# EAGLE design SNAC  7ch SMS DB9 3D (EAGLE 9.0.1)
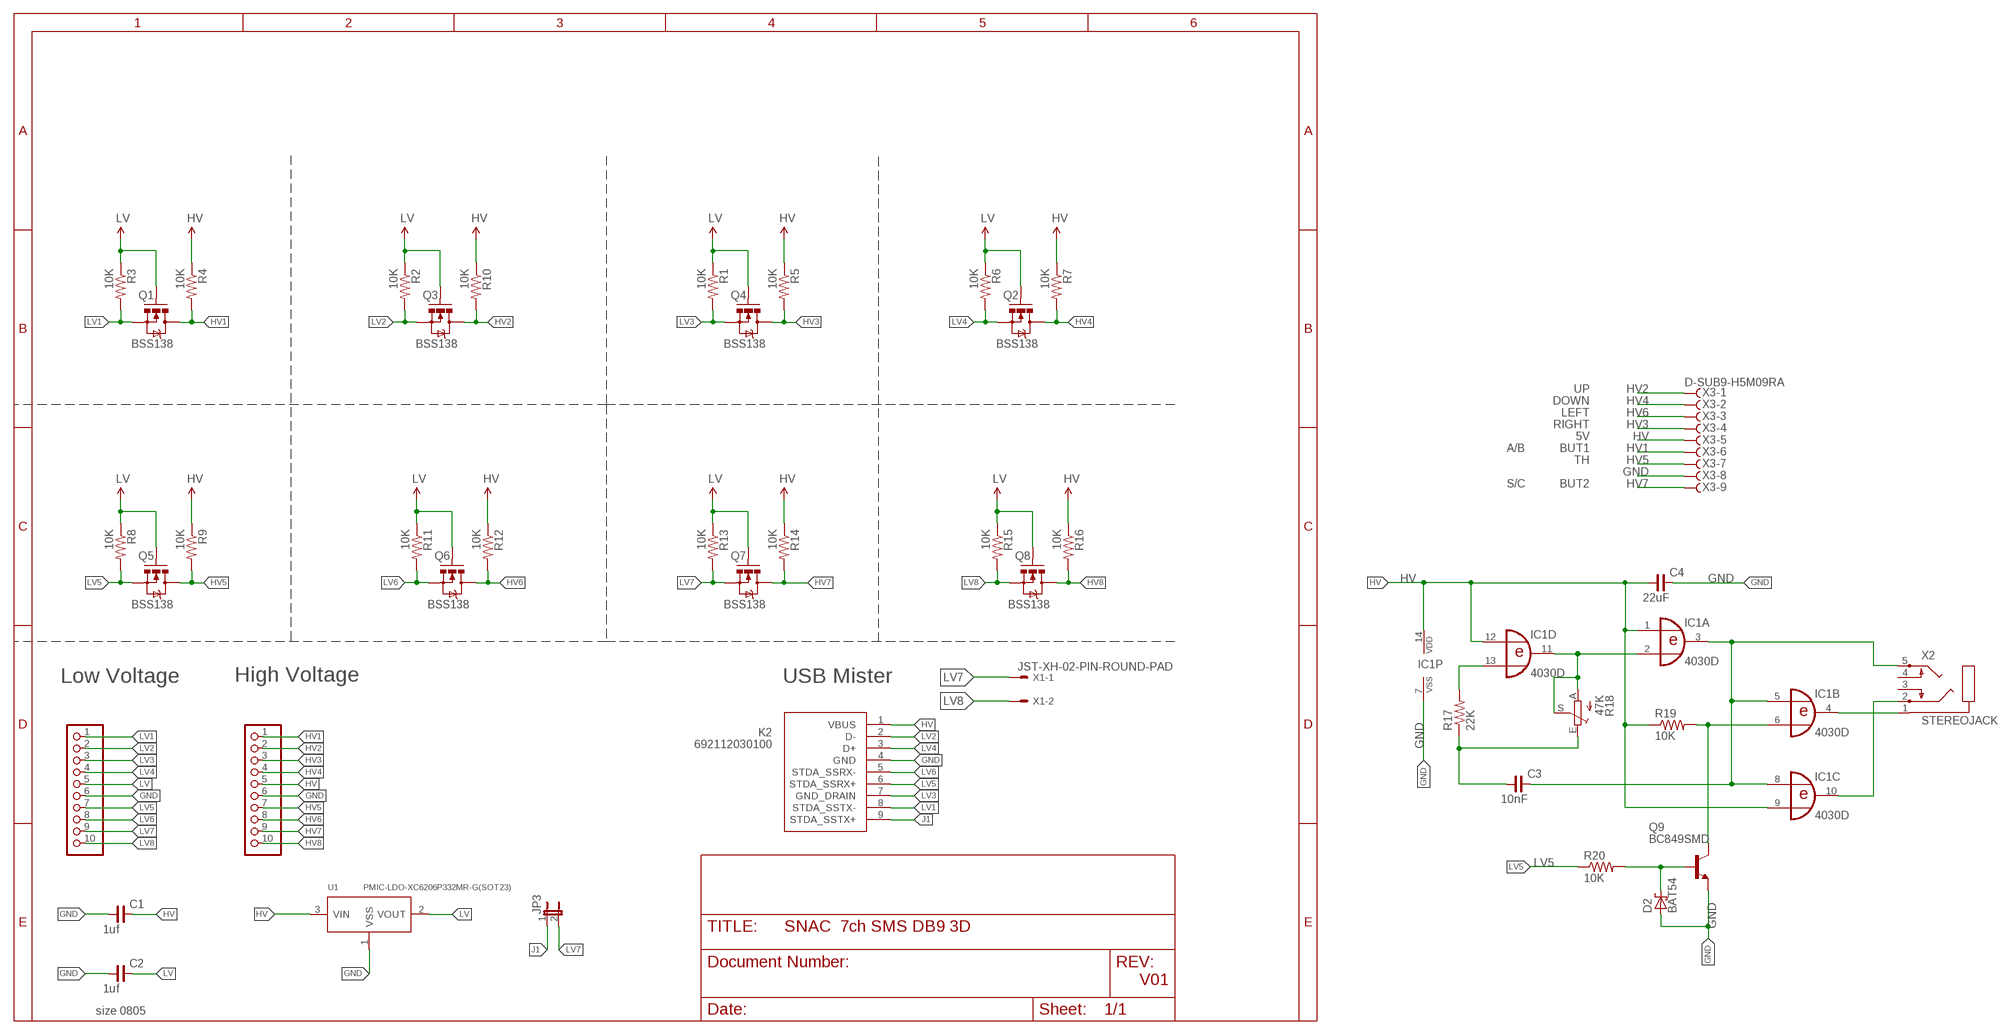
[diagram p0: schematic, sheet 1]

## Parts
C1  1uf  C_0805  [C0805]
C2  1uf  C_0805  [C0805]
C3  10nF  C_0805  [C0805]
C4  22uF  C_0805  [C0805]
D2  BAT54  [SOT23]
IC1  4030D  [SO14]
JP1  PINHD-1X10_2.54-S  [1X10-S]
JP2  PINHD-1X10_2.54-S  [1X10-S]
JP3  JUMPER-2PTH  [1X02]
K2  692112030100  [692112030100]
Q1  BSS138  MOSFET-NCHANNELSMD  [SOT23-3]
Q2  BSS138  MOSFET-NCHANNELSMD  [SOT23-3]
Q3  BSS138  MOSFET-NCHANNELSMD  [SOT23-3]
Q4  BSS138  MOSFET-NCHANNELSMD  [SOT23-3]
Q5  BSS138  MOSFET-NCHANNELSMD  [SOT23-3]
Q6  BSS138  MOSFET-NCHANNELSMD  [SOT23-3]
Q7  BSS138  MOSFET-NCHANNELSMD  [SOT23-3]
Q8  BSS138  MOSFET-NCHANNELSMD  [SOT23-3]
Q9  BC849SMD  [SOT23-BEC]
R1  10K  RESISTOR0603-RES  [0603-RES]
R2  10K  RESISTOR0603-RES  [0603-RES]
R3  10K  RESISTOR0603-RES  [0603-RES]
R4  10K  RESISTOR0603-RES  [0603-RES]
R5  10K  RESISTOR0603-RES  [0603-RES]
R6  10K  RESISTOR0603-RES  [0603-RES]
R7  10K  RESISTOR0603-RES  [0603-RES]
R8  10K  RESISTOR0603-RES  [0603-RES]
R9  10K  RESISTOR0603-RES  [0603-RES]
R10  10K  RESISTOR0603-RES  [0603-RES]
R11  10K  RESISTOR0603-RES  [0603-RES]
R12  10K  RESISTOR0603-RES  [0603-RES]
R13  10K  RESISTOR0603-RES  [0603-RES]
R14  10K  RESISTOR0603-RES  [0603-RES]
R15  10K  RESISTOR0603-RES  [0603-RES]
R16  10K  RESISTOR0603-RES  [0603-RES]
R17  22K  RESISTOR0603-RES  [0603-RES]
R18  47K  TRIM_EU-B25P  [B25P]
R19  10K  RESISTOR0603-RES  [0603-RES]
R20  10K  RESISTOR0603-RES  [0603-RES]
U1  PMIC-LDO-XC6206P332MR-G(SOT23)  [SOT-23]
X1  JST-XH-02-PIN-ROUND-PAD  [JST-XH-02-PACKAGE-ROUND-PAD]
X2  STEREOJACK  [STX3100]
X3  D-SUB9-H5M09RA  [H5M09RA]

## Nets
GND: C1.1 C2.1 C4.2 D2.1(A) IC1.7(P:VSS) JP1.6 JP2.6 K2.4(GND) Q9.E U1.1(VSS) X3.8
HV: C1.2 C4.1 IC1.1(A:I0) IC1.9(C:I1) IC1.12(D:I0) IC1.14(P:VDD) JP2.5 K2.1(VBUS) R4.1 R5.1 R7.1 R9.1 R10.1 R12.1 R14.1 R16.1 R19.1 U1.3(VIN) X3.5
HV1: JP2.1 Q1.3(D) R4.2 X3.6
HV2: JP2.2 Q3.3(D) R10.2 X3.1
HV3: JP2.3 Q4.3(D) R5.2 X3.4
HV4: JP2.4 Q2.3(D) R7.2 X3.2
HV5: JP2.7 Q5.3(D) R9.2 X3.7
HV6: JP2.8 Q6.3(D) R12.2 X3.3
HV7: JP2.9 Q7.3(D) R14.2 X3.9
HV8: JP2.10 Q8.3(D) R16.2
J1: JP3.1 K2.9(STDA_SSTX+)
LV: C2.2 JP1.5 Q1.1(G) Q2.1(G) Q3.1(G) Q4.1(G) Q5.1(G) Q6.1(G) Q7.1(G) Q8.1(G) R1.1 R2.1 R3.1 R6.1 R8.1 R11.1 R13.1 R15.1 U1.2(VOUT)
LV1: JP1.1 K2.8(STDA_SSTX-) Q1.2(S) R3.2
LV2: JP1.2 K2.2(D-) Q3.2(S) R2.2
LV3: JP1.3 K2.7(GND_DRAIN) Q4.2(S) R1.2
LV4: JP1.4 K2.3(D+) Q2.2(S) R6.2
LV5: JP1.7 K2.6(STDA_SSRX+) Q5.2(S) R8.2 R20.1
LV6: JP1.8 K2.5(STDA_SSRX-) Q6.2(S) R11.2
LV7: JP1.9 JP3.2 Q7.2(S) R13.2 X1.1
LV8: JP1.10 Q8.2(S) R15.2 X1.2
N$5: IC1.2(A:I1) IC1.11(D:O) R18.A R18.S
N$6: C3.2 IC1.3(A:O) IC1.5(B:I0) IC1.8(C:I0) X2.5
N$7: IC1.4(B:O) X2.1
N$8: IC1.10(C:O) X2.2
N$9: C3.1 R17.1 R18.E
N$10: IC1.13(D:I1) R17.2
N$13: IC1.6(B:I1) Q9.C R19.2
N$14: D2.3(C) Q9.B R20.2
Unconnected: X2.3 X2.4

## Notes on the sheet
- UP
- DOWN
- LEFT
- RIGHT
- 5V
- A/B | BUT1
- TH
- S/C | BUT2
- Low Voltage | High Voltage | USB Mister
- V01
- size 0805

## Library data of the parts
C1-C4 = rc-master-smd:C_: NON-POLARIZED CAP
D2 = diode:BAT54: Schottky Diodes Source: Fairchild .. BAT54.pdf
IC1 = 40xx:4030: Quad XOR
JP1 JP2 = pinhead-2:PINHD-1X10: PIN HEADER
JP3 = SparkFun:JUMPER-2: Jumper Basic 0.1" spaced jumper. Use with breakaway headers.
K2 = Wuerth_Elektronik_eiCan_Communication_Connectors_STENCIL:692112030100: WR-COM USB 3.0 SMT PLUG WITH CLIPTYPE A
Q1-Q8 = SparkFun:MOSFET-NCHANNEL
Q9 = transistor-npn:BC849*: NPN Transistor
R1-R17 R19 R20 = SparkFun:RESISTOR: Resistor Basic schematic elements and footprints for 0603, 1206, and PTH resistors.
R18 = pot:TRIM_EU-: POTENTIOMETER
U1 = PMIC-LDO-XC6206P332MR-G_SOT23_:PMIC-LDO-XC6206P332MR-G(SOT23): 310030099; AVAILABILITY: Unavailable; DESCRIPTION: SMD PMIC; LDO; Vin 6V; 3.3V; 200mA; Without En; 1-Ch; MF: Torex; MP: XC6206P332MR-G; PACKAGE: SOT-23-3 Torex; PRICE: None
X1 = Rembrandt Electronics - JST XH Connectors v1-0:JST-XH-02-PIN: JST XH Connector 2 Pin Wire to board connector. Pitch: 2,54 mm, (0.100") Number of pins: 2 Created by Rembrandt Electronics www.rembrandtelectronics.com
X2 = adafruit:STEREOJACK: MIC/HEADPHONE JACK Stereo jack with two switches. Kycon STX3100, CUI SJ1-3555NG and/or 4UCon 05544
X3 = con-thomas-betts:D-SUB9-: D-Subminiatur Connector Source: Electronioc Interconnects European Edition 1998; OC_FARNELL: unknown; OC_NEWARK: unknown

## Board
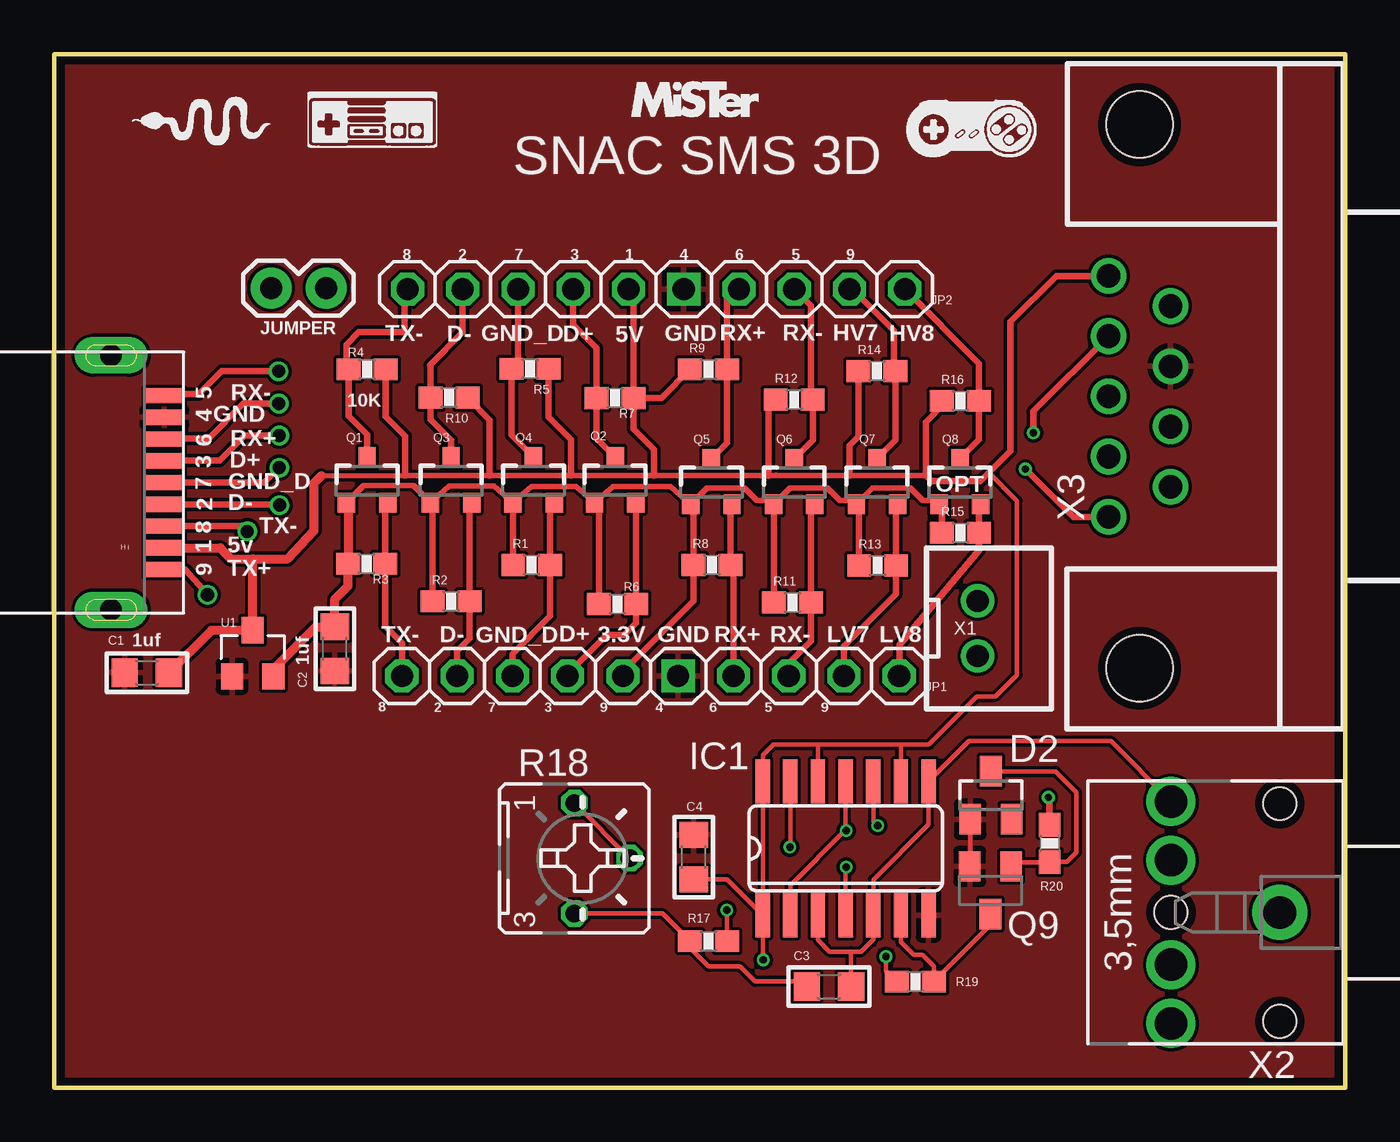
[diagram p1: board, top side]
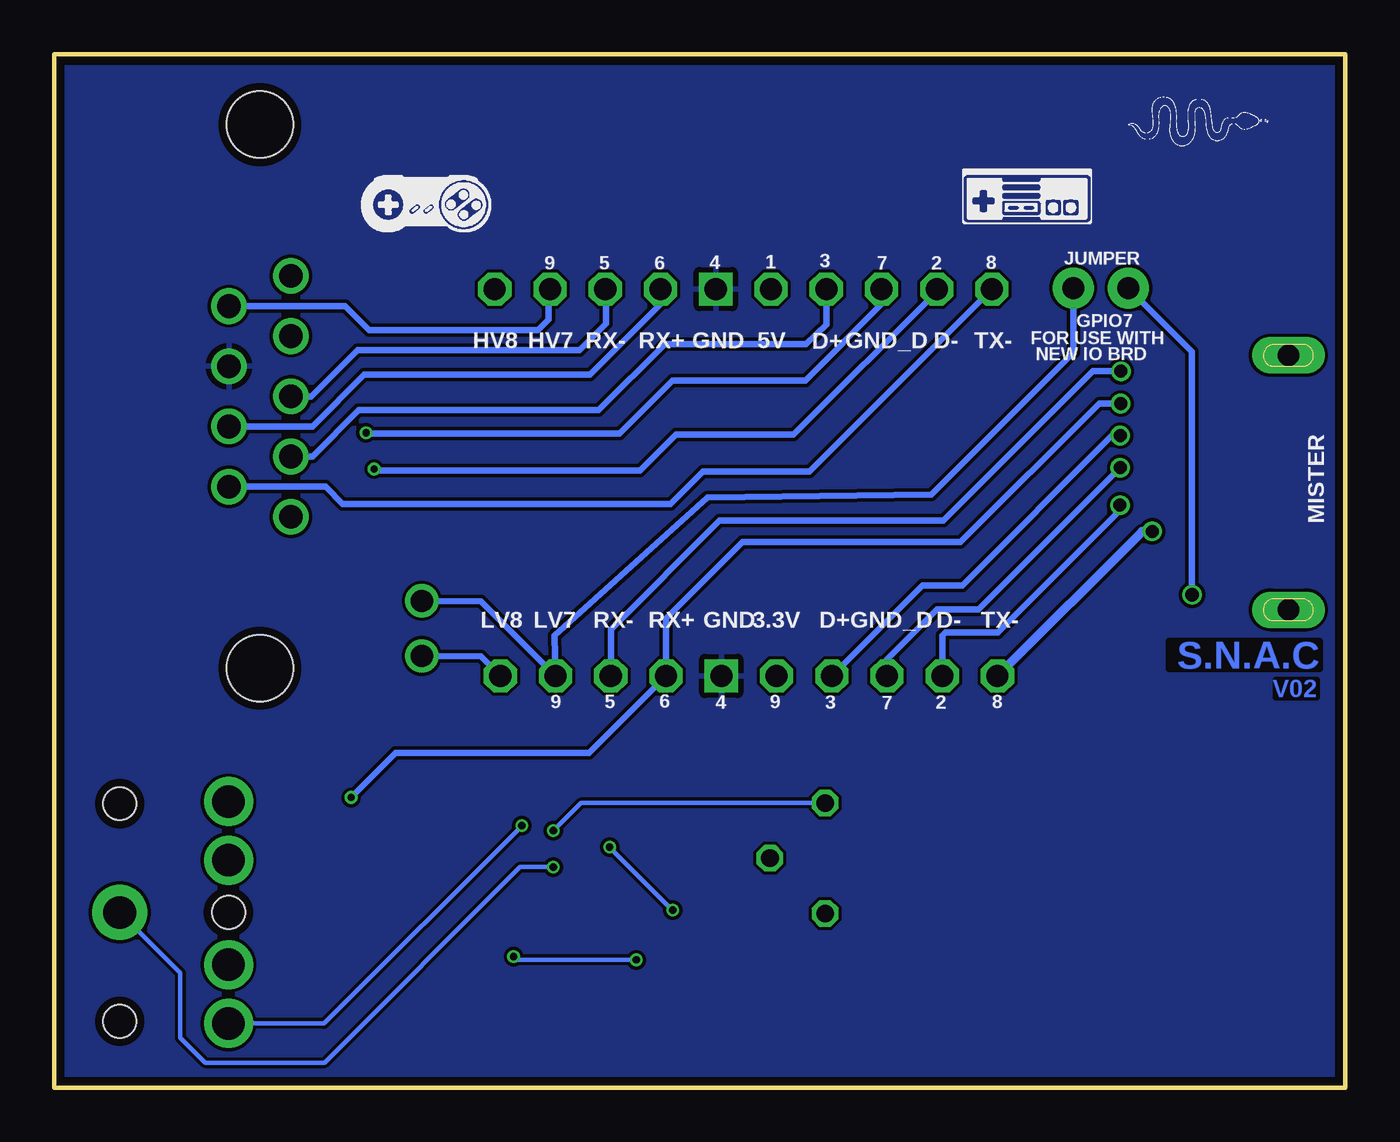
[diagram p2: board, bottom side, seen from below]

Size 59.33 x 47.5 mm. Coordinates in mm from the lower left corner, seen from the top.
Outline: 0,0 59.33,0 59.33,47.5 0,47.5 0,0
Copper layers (1*16): Top 0.035559375mm / dielectric 1.6mm / Bottom 0.035559375mm
Design rules "oshpark-2layer": minimum track width 6mil, minimum drill 10mil, track to track 6mil, track to pad 6mil, pad to pad 6mil, via to via 6mil, smd to smd 6mil, copper to edge 15mil, drill to drill 6mil, minimum pad ring 5mil, minimum via ring 5mil, stop-mask expansion 2.5mil, vias tented up to drill 0mil, thermal gap 10mil

### Footprints (pad centres in the part's own frame; a part is rotated, then mirrored left to right if it is on the bottom)
C0805 = smd 1.2 x 1.3: 1 -1.016,0; 2 1.016,0
SOT23 = smd 1 x 1.4: 1 -0.95,-1.1; 2 0.95,-1.1; 3 0,1.1
SO14 = smd 0.66 x 2.032: 1 -3.81,-3.073; 2 -2.54,-3.073; 3 -1.27,-3.073; 4 0,-3.073; 5 1.27,-3.073; 6 2.54,-3.073; 7 3.81,-3.073; 8 3.81,3.073; 9 2.54,3.073; 10 1.27,3.073; 11 0,3.073; 12 -1.27,3.073; 13 -2.54,3.073; 14 -3.81,3.073
1X10-S = drill 1.016 octagon: 1 -11.43,0; 2 -8.89,0; 3 -6.35,0; 4 -3.81,0; 5 -1.27,0; 7 3.81,0; 8 6.35,0; 9 8.89,0; 10 11.43,0 | drill 1.016 square: 6 1.27,0
1X02 = drill 1.016 pad 1.88: 1 0,0; 2 2.54,0
692112030100 = smd 0.7 x 1.8: 1 -3,0; 2 -1,0; 3 1,0; 4 3,0; 5 4,0; 6 2,0; 7 0,0; 8 -2,0; 9 -4,0 | drill 1 pad 1.676 long: Z1 5.85,2.45; Z2 -5.85,2.45
SOT23-3 = smd 0.8 x 0.9: 1 -0.95,-1; 2 0.95,-1; 3 0,1.1
SOT23-BEC = smd 1 x 1.4: B -0.95,-1.1; C 0,1.1; E 0.95,-1.1
0603-RES = smd 1.1 x 1: 1 -0.85,0; 2 0.85,0
B25P = drill 0.813 octagon: A -2.54,0; E 2.54,0; S 0,2.54
SOT-23 = smd 1.016 x 1.2: 1 -0.95,-1.06; 2 0.95,-1.06; 3 0,1.06
JST-XH-02-PACKAGE-ROUND-PAD = drill 1.016: 1 -1.27,0; 2 1.27,0
STX3100 = drill 1.5 pad 2.54: 1 2.7,-0.1 | drill 1.5: 2 7.7,5; 3 7.7,2.3; 4 7.7,-2.5; 5 7.7,-5.2 | hole 1.5: 2.7,4.9; 2.7,-5.1; 7.7,-0.1
H5M09RA = drill 1.092: 1 -5.537,1.422; 2 -2.769,1.422; 3 0,1.422; 4 2.769,1.422; 5 5.537,1.422; 6 -4.153,-1.422; 7 -1.384,-1.422; 8 1.384,-1.422; 9 4.153,-1.422 | hole 3.048: -12.497,0; 12.497,0

### Placement (x,y rotation side)
C1  4.25,19.07 0 top
C2  12.89,20.17 90 top
C3  35.61,4.65 0 top
C4  29.39,10.59 90 top
D2  43.05,13.44 0 top
IC1  36.37,11 0 top
JP1  27.41,18.92 0 top
JP2  27.66,36.7 0 top
JP3  9.96,36.75 0 top
K2  5.05,27.81 90 top
Q1  14.38,27.89 0 top
Q2  25.78,27.89 0 top
Q3  18.24,27.89 0 top
Q4  22.02,27.89 0 top
Q5  30.2,27.81 0 top
Q6  34.01,27.81 0 top
Q7  37.82,27.81 0 top
Q8  41.63,27.81 0 top
Q9  43.03,9.07 180 top
R1  21.95,24.03 0 top
R2  18.24,22.35 0 top
R3  14.35,24.08 0 top
R4  14.37,33.01 180 top
R5  21.87,33.05 180 top
R6  25.88,22.23 0 top
R7  25.78,31.7 180 top
R8  30.23,24.03 0 top
R9  30.07,33.02 0 top
R10  18.14,31.72 180 top
R11  33.93,22.3 0 top
R12  34.01,31.62 0 top
R13  37.85,24 0 top
R14  37.82,32.94 0 top
R15  41.66,25.5 0 top
R16  41.66,31.57 0 top
R17  30.07,6.73 0 top
R18  23.9,10.54 270 top
R19  39.57,4.88 0 top
R20  45.75,11.23 270 top
U1  9.12,19.96 0 top
X1  42.44,21.11 270 top
X2  59.03,7.95 180 top
X3  49.89,31.78 90 top

### Tracks (layer width: path | path; a pad name or v marks a point on that pad's centre or on a via)
GND
  Top 0.203: 42.08,9.82 Q9.E 42.1,10.35 D2.1 | 29.41,11.58 C4.2
  pour Top: -0.03,47.5 59.23,47.47 59.36,-0.05 0,0
  pour Bottom: -0.03,47.47 59.28,47.55 59.44,-0.05 0.05,0
HV  (via drill 0.33)
  Top 0.178: 5.13,24.89 K2.1 | 12.29,28.09 12.27,28.12 | JP2.5 26.63,36.46 | R7.1 26.52,31.59 | 33.16,28.18 33.12,28.14 | R16.1 40.92,31.46
  Top 0.203: C4.1 30.91,9.58 32.46,8.03 | 32.46,8.03 IC1.1 32.56,5.89 v32.59,5.87 | 32.46,8.03 32.56,8.13 IC1.14 32.56,15.29 33.05,15.77 35.1,15.77 | 35.1,15.77 38.91,15.77 | 38.91,15.77 40.21,15.77 42.42,17.98 43.26,17.98 44.25,18.97 44.25,26.98 42.95,28.27 | IC1.12 35.1,15.77 | v38.23,6.02 38.23,5.37 R19.1 | IC1.9 38.91,15.77
  Top 0.254: 12.27,28.12 16.13,28.14 17.02,28.14 20.02,28.14 23.75,28.14 27.56,28.14 32.82,28.14 33.12,28.14 36.55,28.14 40.06,28.14
  Top 0.305: 26.63,36.46 R7.1 | R9.1 27.9,31.7 R7.1 | R14.1 36.97,29.93 36.55,29.52 36.55,28.14 | 40.92,31.46 40.06,30.59 40.06,28.14 40.31,27.89 42.57,27.89 42.95,28.27 43.94,29.26 43.94,35.2 46.05,37.31 X3.5 | R4.1 15.22,30.85 16.13,29.95 16.13,28.14 | R10.1 20.02,30.7 20.02,28.14 | R5.1 22.72,30.82 23.75,29.79 23.75,28.14 | R7.1 26.63,30.27 27.56,29.34 27.56,28.14 | R12.1 32.82,31.28 32.82,28.14
  Top 0.406: C1.2 7.22,21.02 U1.3 9.12,24.31 | K2.1 7.62,24.81 8.13,24.31 9.12,24.31 | 9.12,24.31 10.72,24.31 11.94,25.6 11.94,27.79 12.27,28.12
  Bottom 0.203: v32.59,5.87 38.07,5.87 v38.23,6.02
HV1
  Top 0.178: 16.1,36.7 JP2.1 | 13.44,33.1 R4.2
  Top 0.305: 16.1,36.7 16.1,34.72 14,34.72 13.44,34.16 13.44,33.1 | Q1.3 14.38,30.02 13.52,30.88 R4.2
  Bottom 0.305: JP2.1 24.61,28.32 29.51,28.32 31.01,26.82 46.08,26.82 46.88,27.62 X3.6
HV2  (via drill 0.33)
  Top 0.178: 17.27,33.22 17.29,33.21 | 17.3,31.71 R10.2
  Top 0.305: JP2.2 18.77,34.72 17.27,33.22 | 17.29,33.21 R10.2 | Q3.3 18.24,29.77 17.3,30.71 17.3,31.71 | v44.64,28.43 46.83,26.24 X3.1
  Bottom 0.178: JP2.2 18.77,36.6
  Bottom 0.305: 18.77,36.6 25.35,30.02 30.76,30.02 32.41,28.37 44.5,28.37 v44.64,28.43
HV3  (via drill 0.33)
  Top 0.178: 21.25,36.7 JP2.3 | Q4.3 22.02,29.31 | R5.2 21.31,33.34
  Top 0.305: 21.31,33.34 JP2.3 | R5.2 21.02,29.99 Q4.3 | v45.01,30.1 45.01,31.09 X3.4
  Bottom 0.305: JP2.3 21.31,36.02 24.82,32.51 30.91,32.51 33.35,30.07 44.98,30.07 v45.01,30.1
HV4
  Top 0.305: JP2.4 23.85,35.08 24.93,34 R7.2 24.93,29.84 Q2.3
  Bottom 0.178: 23.85,36.83 JP2.4
  Bottom 0.305: JP2.4 23.85,35.08 24.79,34.19 31.27,34.19 34.32,31.14 45.34,31.14 47.47,29.01 X3.2
HV5
  Top 0.178: 31.34,36.7 JP2.7
  Top 0.305: Q5.3 30.92,29.64 R9.2 30.92,36.28 31.34,36.7
  Bottom 0.178: 31.37,36.6 JP2.7
  Bottom 0.305: JP2.7 31.47,36.02 34.72,32.77 45.08,32.77 47.46,30.39 X3.7
HV6
  Top 0.178: 34.77,31.71 R12.2
  Top 0.305: JP2.8 34.77,35.94 34.77,31.71 | Q6.3 34.86,29.76 R12.2
  Bottom 0.178: JP2.8 33.99,36.68
  Bottom 0.305: 33.99,36.68 33.99,35.13 35.2,33.91 45.39,33.91 47.52,31.77 X3.3
HV7
  Top 0.178: 36.68,36.7 JP2.9 | 38.58,33.03 R14.2
  Top 0.305: 36.68,36.7 38.58,34.8 38.58,33.03 | Q7.3 38.67,29.76 R14.2
  Bottom 0.305: JP2.9 36.63,36.63 36.63,35.31 37.11,34.82 44.86,34.82 45.96,35.93 X3.9
HV8
  Top 0.305: Q8.3 42.51,29.79 R16.2 42.51,33.29 JP2.10
J1  (via drill 0.6)
  Top 0.305: K2.9 6.01,23.81 v7.04,22.66
  Bottom 0.305: v7.04,22.66 7.04,33.83 JP3.1
LV
  Top 0.178: 24.93,26.99 Q2.1 | 17.22,26.89 Q3.1 17.41,26.76 17.39,26.74 | Q2.1 | 33.25,26.99 33.24,26.99 Q6.1 | Q8.1 | 40.51,26.99 Q8.1 | 36.7,26.99 Q7.1 | 33.16,26.71 Q6.1 | 32.89,26.99 Q6.1 | Q2.1 24.74,26.8 25.03,26.5 | 29.31,26.87 Q5.1 29.38,26.69 | JP1.5 26.14,19.13 | Q4.1 21.17,26.79 21.1,26.71 | 16.51,27.67 | Q8.1 | Q1.1 13.5,26.81 | 29.38,24.54 R8.1 | 29.36,22.35 29.38,22.37 | 33.08,26.79 Q6.1
  Top 0.254: 16.51,27.67 14.21,27.67 Q1.1 | 40.51,26.99 39.92,26.99 39.34,27.56 37.62,27.56 Q7.1 | 36.7,26.99 36.11,26.99 35.53,27.56 33.81,27.56 33.24,26.99 | 32.89,26.99 32.3,26.99 31.72,27.56 30,27.56 Q5.1 28.31,27.62 25.69,27.62 Q2.1 23.97,27.62 21.93,27.62 Q4.1 20.21,27.65 18.15,27.65 Q3.1 16.51,27.67
  Top 0.305: 26.14,19.13 29.36,22.35 | 17.39,26.74 R2.1 | 21.1,26.71 R1.1 | 25.03,26.5 R6.1 | 29.38,26.69 29.38,24.54 | 29.38,22.37 R8.1 | R11.1 33.08,26.79 | 40.81,26.81 R15.1 | 37,26.81 R13.1
  Top 0.406: 13.5,26.81 R3.1 13.5,23.05 12.89,22.44 C2.2 12.01,21.18 10.07,19.24 U1.2 | Q8.1 40.81,26.81 | Q7.1 37,26.81
LV1  (via drill 0.6)
  Top 0.178: Q1.2 15.2,26.76
  Top 0.305: JP1.1 15.98,20.45 15.2,21.22 R3.2 15.2,26.76 | K2.8 8.62,25.81 v8.87,25.57
  Bottom 0.406: JP1.1 9.33,25.57 v8.87,25.57
LV2  (via drill 0.6)
  Top 0.178: Q3.2 19.09,26.79
  Top 0.305: JP1.2 18.52,20.07 19.09,20.64 R2.2 19.09,26.79 | K2.2 10.31,26.81 v10.35,26.77
  Bottom 0.178: 15.93,20.93 15.95,20.93
  Bottom 0.305: v10.35,26.77 10.35,26.53 15.95,20.93 18.36,20.93 18.52,20.78 JP1.2
LV3  (via drill 0.6)
  Top 0.178: Q4.2 22.8,26.71
  Top 0.305: K2.7 9.65,27.81 v10.34,28.5 | JP1.3 21.06,19.94 22.8,21.68 R1.2 22.8,26.71
  Bottom 0.178: 21.06,19.68 JP1.3
  Bottom 0.305: 21.06,19.68 18.77,21.97 16.87,21.97 v10.34,28.5
LV4  (via drill 0.6)
  Top 0.178: 5.05,28.83 K2.3 | JP1.4 23.6,19.02 | Q2.2 26.71,26.87 26.73,26.84 | 26.73,22.16 R6.2
  Top 0.305: 5.05,28.83 7.59,28.83 8.74,29.97 v10.34,29.97 | 26.73,26.84 R6.2 26.73,21.35 26.19,20.8 25.37,20.8 23.6,19.02
  Bottom 0.305: JP1.4 19.43,23.09 17.6,23.09 10.72,29.97 v10.34,29.97
LV5  (via drill 0.33, 0.6)
  Top 0.178: 5.05,29.84 K2.6 | Q5.2 31.08,26.74 | R8.2 31.22,23.89
  Top 0.305: 5.05,29.84 7.09,29.84 8.69,31.45 v10.31,31.45 | 31.08,26.74 R8.2 | 31.22,23.89 JP1.7 | v45.69,13.33 45.75,13.28 R20.1
  Bottom 0.305: v10.31,31.45 11.3,31.45 17.68,25.07 27.71,25.07 31.22,21.56 JP1.7 34.75,15.39 43.64,15.39 v45.69,13.33
LV6  (via drill 0.6)
  Top 0.178: 5.05,31.88 K2.5 | Q6.2 34.77,26.62 34.78,26.61 | 6.63,31.88 6.62,31.88
  Top 0.305: 5.05,31.88 6.63,31.88 7.68,32.93 v10.31,32.93 | 34.78,26.61 R11.2 34.78,20.54 33.76,19.51 JP1.8
  Bottom 0.305: JP1.8 33.76,21.06 28.75,26.06 18.47,26.06 11.6,32.93 v10.31,32.93
LV7
  Top 0.178: Q7.2 38.7,26.74
  Top 0.305: JP1.9 36.3,20.29 38.7,22.69 R13.2 38.7,26.74
  Bottom 0.305: JP3.2 12.5,33.78 19.02,27.25 29.31,27.13 36.35,20.78 JP1.9 39.73,22.35 X1.1
LV8
  Top 0.178: 42.39,26.62 Q8.2
  Top 0.305: JP1.10 38.84,20.34 42.51,24.7 R15.2 42.51,26.62
  Top 0.406: 42.39,26.62 42.51,26.62
  Bottom 0.305: JP1.10 39.73,19.81 X1.2
N$5  (via drill 0.33)
  Top 0.203: 36.4,14.05 IC1.11 36.37,11.84 | R18.A R18.S | v36.4,11.81 36.37,11.84 | IC1.2 33.83,9.3 36.37,11.84
  Bottom 0.203: R18.A 35.13,13.08 v36.4,11.81
N$6
  Top 0.203: X2.5 48.55,15.93 42.04,15.93 IC1.8 40.18,12.09 37.64,9.55 IC1.5 37.64,6.81 37.08,6.25 36.63,6.25 | IC1.3 35.1,6.78 35.64,6.25 36.63,6.25 | C3.2 36.63,6.25
N$7  (via drill 0.33)
  Top 0.203: v36.4,10.13 36.37,10.11 IC1.4
  Bottom 0.203: X2.1 53.54,5.26 53.54,2.29 52.4,1.14 46.91,1.14 37.92,10.13 v36.4,10.13
N$8  (via drill 0.33)
  Top 0.203: IC1.10 37.64,12.24 v37.85,12.04
  Bottom 0.203: v37.85,12.04 46.94,2.95 X2.2
N$9
  Top 0.203: 29.13,6.83 27.95,8 R18.E | 29.13,6.83 R17.1 | C3.1 34.37,4.88 32.21,4.88 31.52,5.56 30.07,5.56 29.13,6.51 29.13,6.83
N$10  (via drill 0.33)
  Top 0.203: v30.91,8.15 30.92,8.14 R17.2 | v33.81,11.05 33.83,11.07 IC1.13
  Bottom 0.203: v30.91,8.15 v33.81,11.05
N$13
  Top 0.203: 38.91,7.01 IC1.6 38.91,6.71 39.52,6.1 39.9,6.1 40.42,5.58 R19.2 43.03,7.48 Q9.C
N$14
  Top 0.203: Q9.B 44.01,10.35 45.72,10.35 R20.2 46.55,10.38 46.99,10.82 46.99,13.56 46.02,14.54 D2.3

### Text on the board
Bottom: S.N.A.C | V02
tPlace: SNAC SMS 3D | 8 | 2 | 7 | 3 | 1 | 4 | 6 | 5 | 9 | RX+ | RX- | HV7 | HV8 | JUMPER | TX- | D- | GND_D | D+ | 5V | GND | 5 | RX- | 10K | 4 | GND | 6 | RX+ | 3 | D+ | OPT | 7 | GND_D | 2 | D- | H i | 8 | TX- | 1 | 5v | 9 | TX+ | 1uf | TX- | D- | GND_D | D+ | 3.3V | GND | RX+ | RX- | LV7 | LV8 | 1uf | 8 | 2 | 7 | 3 | 9 | 4 | 6 | 5 | 9
bPlace: JUMPER | 3 | 8 | 2 | 7 | 1 | 4 | 6 | 5 | 9 | GPIO7 | FOR USE WITH | TX- | D- | GND_D | D+ | 5V | GND | RX+ | RX- | HV7 | HV8 | NEW IO BRD | MISTER | TX- | D- | GND_D | D+ | 3.3V | GND | RX+ | RX- | LV7 | LV8 | 8 | 2 | 7 | 3 | 9 | 4 | 6 | 5 | 9
tValues: + | -